# Altium schematic sheet Main.SchDoc: Knattebol Controller
size 431 x 279 mm; Date: 2021-10-17; ApprovedBy: Motonaut; CheckedBy: Motonaut; Author: Motonaut; CompanyName: Motonaut Inc.; DrawnBy: Motonau; Engineer: Motonaut; Organization: ETA; Address1: Rännvägen 4B; Address2: 412 96; Address3: Göteborg; Address4: Sweden; DocumentNumber: 3; Revision: REV C; SheetNumber: 1; SheetTotal: 2; Project: Knattebol; ENG_APP_DATE: --/--/--; DSN_APP_DATE: --/--/--; CHK_APP_DATE: --/--/--; Time: 14:33
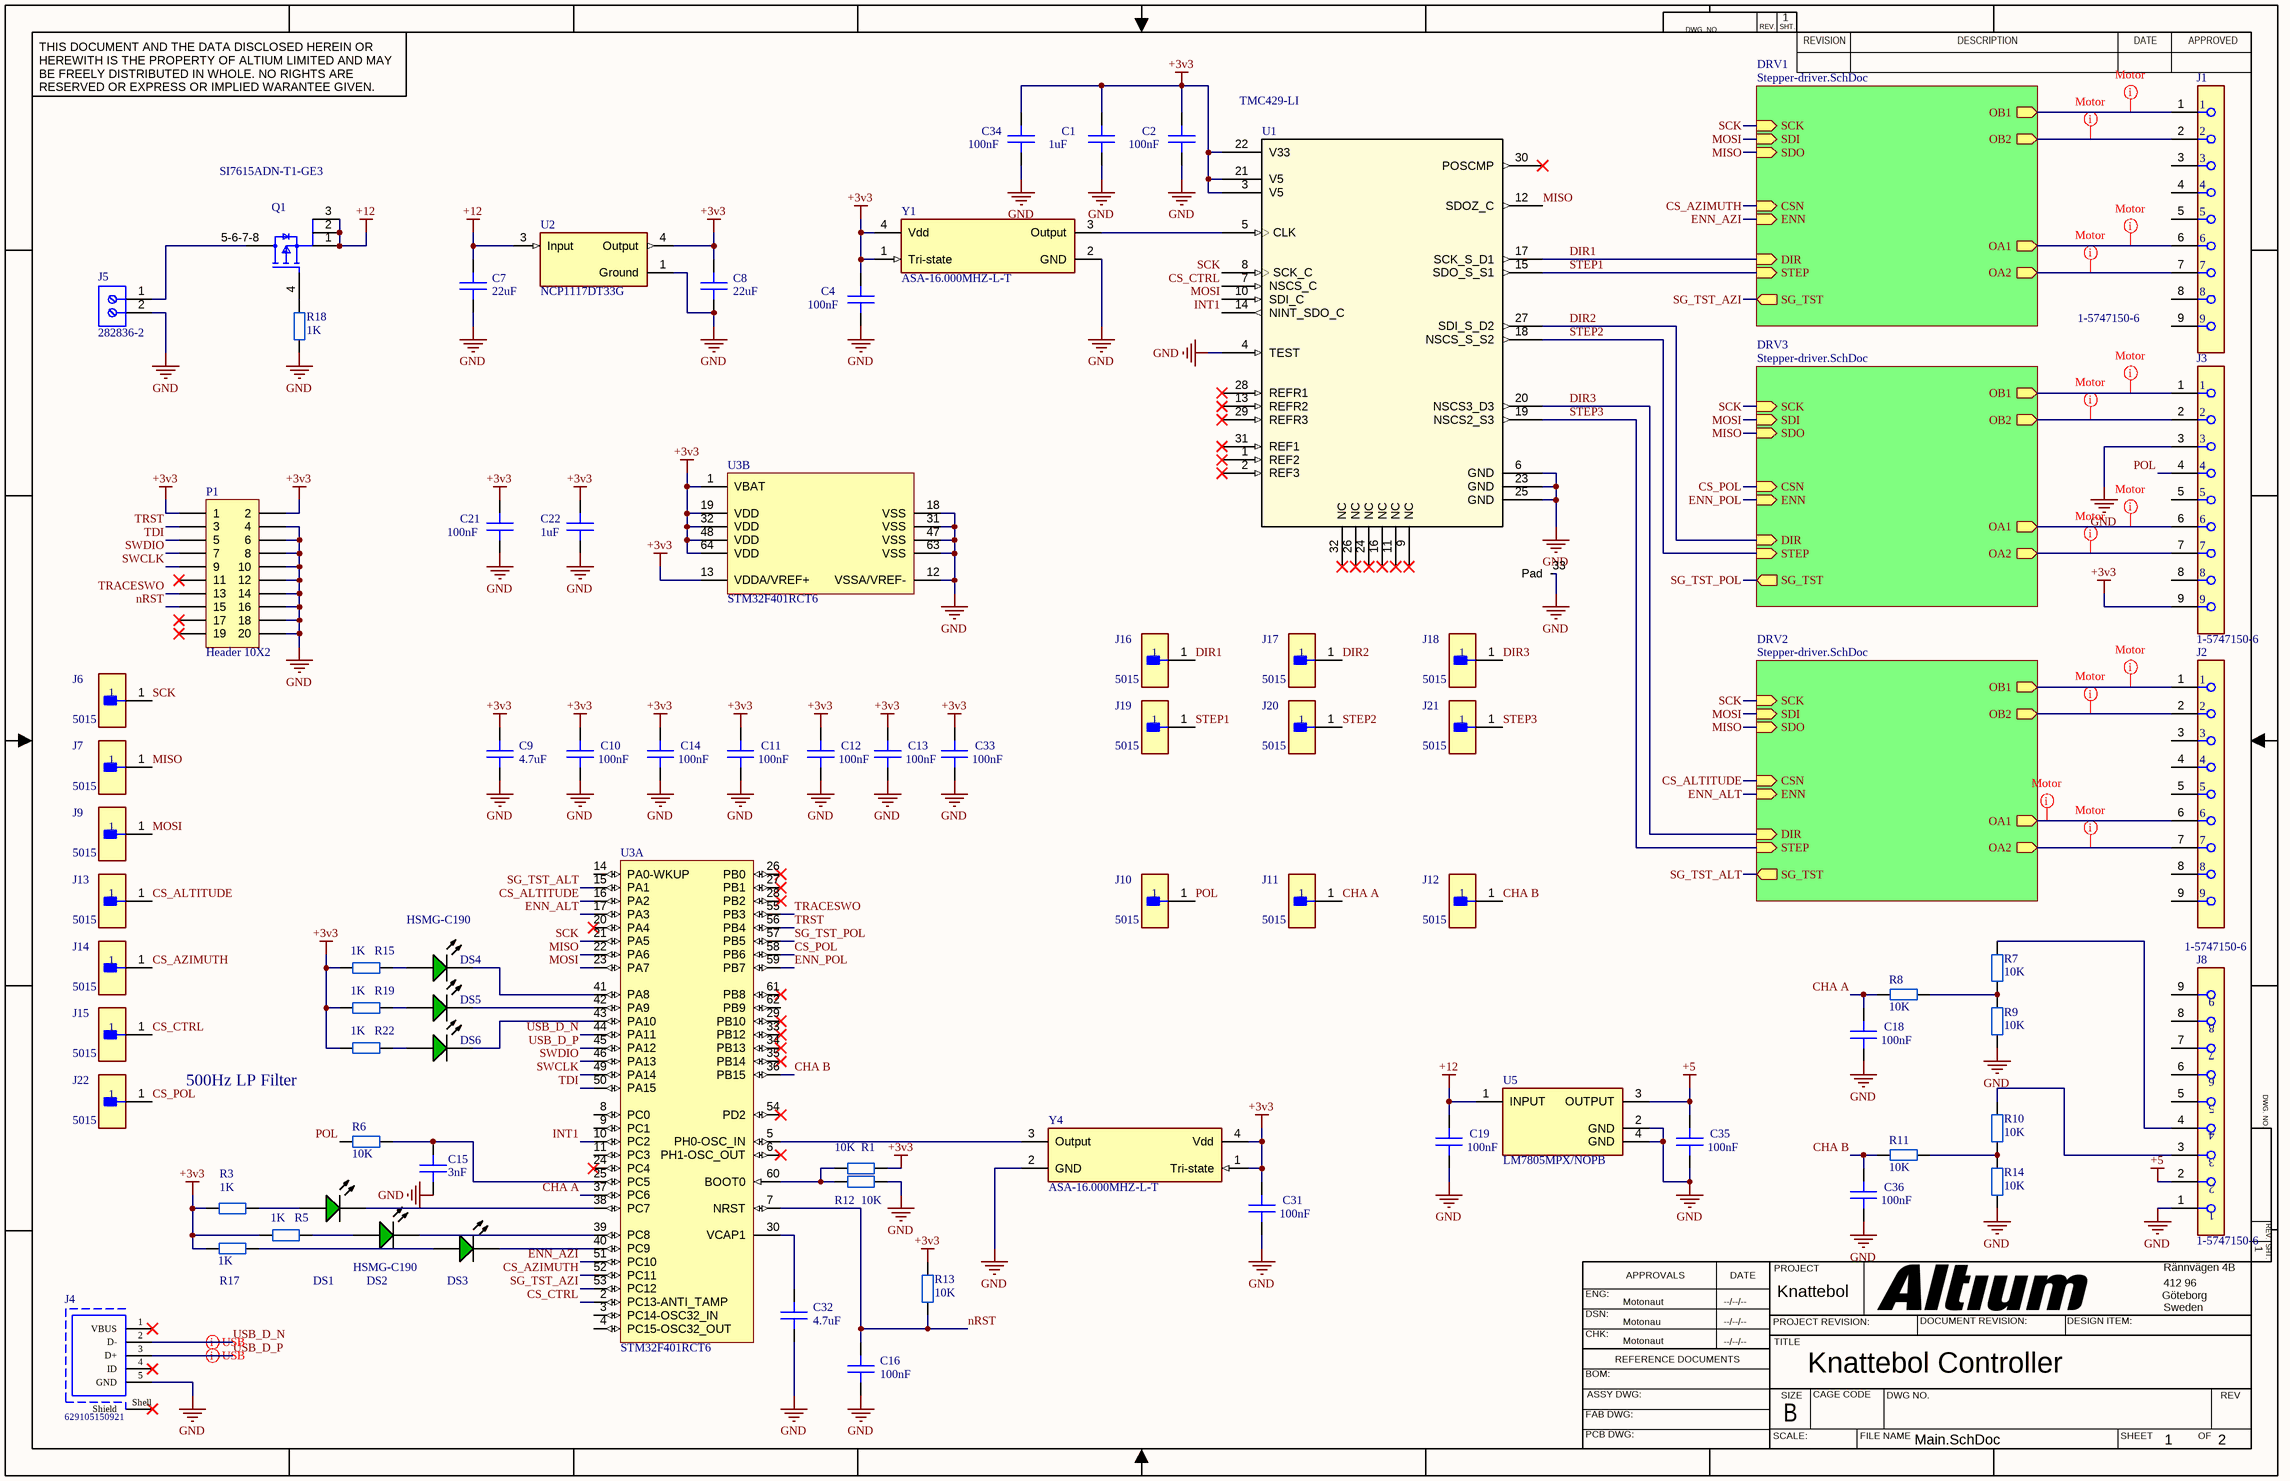
[diagram p0: Main.SchDoc]

## Parts
C1  value 1uF  [C0603 (1608)]  (hidden comment: Cap SMD)
C2  value 100nF  [C0603 (1608)]  (hidden comment: Cap SMD)
C4  value 100nF  [C0603 (1608)]  (hidden comment: Cap SMD)
C7  value 22uF  [C0603 (1608)]  (hidden comment: Cap SMD)
C8  value 22uF  [C0603 (1608)]  (hidden comment: Cap SMD)
C9  value 4.7uF  [C0603 (1608)]  (hidden comment: Cap SMD)
C10  value 100nF  [C0603 (1608)]  (hidden comment: Cap SMD)
C11  value 100nF  [C0603 (1608)]  (hidden comment: Cap SMD)
C12  value 100nF  [C0603 (1608)]  (hidden comment: Cap SMD)
C13  value 100nF  [C0603 (1608)]  (hidden comment: Cap SMD)
C14  value 100nF  [C0603 (1608)]  (hidden comment: Cap SMD)
C15  value 3nF  [C0603 (1608)]  (hidden comment: Cap SMD)
C16  value 100nF  [C0603 (1608)]  (hidden comment: Cap SMD)
C18  value 100nF  [C0603 (1608)]  (hidden comment: Cap SMD)
C19  value 100nF  [C0603 (1608)]  (hidden comment: Cap SMD)
C21  value 100nF  [C0603 (1608)]  (hidden comment: Cap SMD)
C22  value 1uF  [C0603 (1608)]  (hidden comment: Cap SMD)
C31  value 100nF  [C0603 (1608)]  (hidden comment: Cap SMD)
C32  value 4.7uF  [C0603 (1608)]  (hidden comment: Cap SMD)
C33  value 100nF  [C0603 (1608)]  (hidden comment: Cap SMD)
C34  value 100nF  [C0603 (1608)]  (hidden comment: Cap SMD)
C35  value 100nF  [C0603 (1608)]  (hidden comment: Cap SMD)
C36  value 100nF  [C0603 (1608)]  (hidden comment: Cap SMD)
DS1  HSMG-C190  [AVAG-HSMX-C190_V]  (value not drawn)
DS2  HSMG-C190  [AVAG-HSMX-C190_V]  (value not drawn)
DS3  HSMG-C190  [AVAG-HSMX-C190_V]
DS4  HSMG-C190  [AVAG-HSMX-C190_V]
DS5  HSMG-C190  [AVAG-HSMX-C190_V]  (value not drawn)
DS6  HSMG-C190  [AVAG-HSMX-C190_V]  (value not drawn)
J1  1-5747150-6  [FP-1-5747150-6-MFG]
J2  1-5747150-6  [FP-1-5747150-6-MFG]
J3  1-5747150-6  [FP-1-5747150-6-MFG]
J4  629105150921  [629105150921]
J5  282836-2  [TECO-282836-2_V]
J6  5015  [FP-5015-MFG]
J7  5015  [FP-5015-MFG]
J8  1-5747150-6  [FP-1-5747150-6-MFG]
J9  5015  [FP-5015-MFG]
J10  5015  [FP-5015-MFG]
J11  5015  [FP-5015-MFG]
J12  5015  [FP-5015-MFG]
J13  5015  [FP-5015-MFG]
J14  5015  [FP-5015-MFG]
J15  5015  [FP-5015-MFG]
J16  5015  [FP-5015-MFG]
J17  5015  [FP-5015-MFG]
J18  5015  [FP-5015-MFG]
J19  5015  [FP-5015-MFG]
J20  5015  [FP-5015-MFG]
J21  5015  [FP-5015-MFG]
J22  5015  [FP-5015-MFG]
P1  Header 10X2  [HDR2X10]
Q1  SI7615ADN-T1-GE3  [FP-S16-2667_SINGLE-MFG]
R1  10K  [R0603 (1608)]
R3  1K  [R0603 (1608)]
R5  1K  [R0603 (1608)]
R6  10K  [R0603 (1608)]
R7  10K  [R0603 (1608)]
R8  10K  [R0603 (1608)]
R9  10K  [R0603 (1608)]
R10  10K  [R0603 (1608)]
R11  10K  [R0603 (1608)]
R12  10K  [R0603 (1608)]
R13  10K  [R0603 (1608)]
R14  10K  [R0603 (1608)]
R15  1K  [R0603 (1608)]
R17  1K  [R0603 (1608)]
R18  1K  [R0603 (1608)]
R19  1K  [R0603 (1608)]
R22  1K  [R0603 (1608)]
U1  TMC429-LI  [QFN32_5X5_TRI-M]
U2  NCP1117DT33G  [FP-369C-MFG]
U3  STM32F401RCT6  [STM-LQFP64_M]  (parts A,B of 2)
U5  LM7805MPX/NOPB  [FP-LM7805MPX-NOPB-MFG]
Y1  ASA-16.000MHZ-L-T  [FP-ASA-MFG]
Y4  ASA-16.000MHZ-L-T  [FP-ASA-MFG]

## Sub-sheets
DRV1 = Stepper-driver.SchDoc: SCK (in), SDI (in), SDO (in), CSN (in), ENN (in), DIR (in), STEP (in), SG_TST (out), OB1 (out), OB2 (out), OA1 (out), OA2 (out)
DRV2 = Stepper-driver.SchDoc: SCK (in), SDI (in), SDO (in), CSN (in), ENN (in), DIR (in), STEP (in), SG_TST (out), OB1 (out), OB2 (out), OA1 (out), OA2 (out)
DRV3 = Stepper-driver.SchDoc: SCK (in), SDI (in), SDO (in), CSN (in), ENN (in), DIR (in), STEP (in), SG_TST (out), OA2 (out), OA1 (out), OB1 (out), OB2 (out)

## Nets
+3v3: C1.2 C2.2 C4.2 C8.2 C9.2 C10.2 C11.2 C12.2 C13.2 C14.2 C21.2 C22.2 C31.2 C33.2 C34.2 J3.9 P1.1 P1.2 R1.2 R3.1 R5.1 R13.2 R15.1 R17.1 R19.1 R22.1 U1.3(V5) U1.21(V5) U1.22(V33) U2.4(Output) U3.1(VBAT) U3.13(VDDA/VREF+) U3.19(VDD) U3.32(VDD) U3.48(VDD) U3.64(VDD) Y1.1(Tri-state) Y1.4(Vdd) Y4.1(Tri-state) Y4.4(Vdd)
+5: C35.2 J8.2 U5.3(OUTPUT)
+12: C7.2 C19.2 Q1.1(S) Q1.2(S) Q1.3(S) U2.3(Input) U5.1(INPUT)
GND: C1.1 C2.1 C4.1 C7.1 C8.1 C9.1 C10.1 C11.1 C12.1 C13.1 C14.1 C15.1 C16.1 C18.1 C19.1 C21.1 C22.1 C31.1 C32.1 C33.1 C34.1 C35.1 C36.1 J3.3 J4.5(GND) J5.2 J8.1 P1.4 P1.6 P1.8 P1.10 P1.12 P1.14 P1.16 P1.18 P1.20 R9.1 R12.2 R14.1 R18.1 U1.4(TEST) U1.6(GND) U1.23(GND) U1.25(GND) U1.33(Pad) U2.1(Ground) U3.12(VSSA/VREF-) U3.18(VSS) U3.31(VSS) U3.47(VSS) U3.63(VSS) U5.2(GND) U5.4(GND) Y1.2(GND) Y4.2(GND)
CHA A: C18.2 J11.1 R8.2 U3.37(PC6)
CHA B: C36.2 J12.1 R11.2 U3.36(PB15)
CS_ALTITUDE: J13.1 U3.16(PA2) ; sheet DRV2/CSN
CS_AZIMUTH: J14.1 U3.52(PC11) ; sheet DRV1/CSN
CS_CTRL: J15.1 U1.7(NSCS_C) U3.2(PC13-ANTI_TAMP)
CS_POL: J22.1 U3.58(PB6) ; sheet DRV3/CSN
DIR1: J16.1 U1.17(SCK_S_D1) ; sheet DRV1/DIR
DIR2: J17.1 U1.27(SDI_S_D2) ; sheet DRV3/DIR
DIR3: J18.1 U1.20(NSCS3_D3) ; sheet DRV2/DIR
ENN_ALT: U3.17(PA3) ; sheet DRV2/ENN
ENN_AZI: U3.51(PC10) ; sheet DRV1/ENN
ENN_POL: U3.59(PB7) ; sheet DRV3/ENN
INT1: U1.14(NINT_SDO_C) U3.10(PC2)
MISO: J7.1 U1.12(SDOZ_C) U3.22(PA6) ; sheet DRV2/SDO, sheet DRV3/SDO, sheet DRV1/SDO
MOSI: J9.1 U1.10(SDI_C) U3.23(PA7) ; sheet DRV2/SDI, sheet DRV3/SDI, sheet DRV1/SDI
nRST: C16.2 P1.15 R13.1 U3.7(NRST)
POL: J3.4 J10.1 R6.1
SCK: J6.1 U1.8(SCK_C) U3.21(PA5) ; sheet DRV2/SCK, sheet DRV3/SCK, sheet DRV1/SCK
SG_TST_ALT: U3.15(PA1) ; sheet DRV2/SG_TST
SG_TST_AZI: U3.53(PC12) ; sheet DRV1/SG_TST
SG_TST_POL: U3.57(PB5) ; sheet DRV3/SG_TST
STEP1: J19.1 U1.15(SDO_S_S1) ; sheet DRV1/STEP
STEP2: J20.1 U1.18(NSCS_S_S2) ; sheet DRV3/STEP
STEP3: J21.1 U1.19(NSCS2_S3) ; sheet DRV2/STEP
SWCLK: P1.9 U3.49(PA14)
SWDIO: P1.7 U3.46(PA13)
TDI: P1.5 U3.50(PA15)
TRACESWO: P1.13 U3.55(PB3)
TRST: P1.3 U3.56(PB4)
USB_D_N: J4.2(D-) U3.44(PA11)
USB_D_P: J4.3(D+) U3.45(PA12)
NetC15_2: C15.2 R6.2 U3.25(PC5)
NetC32_2: C32.2 U3.30(VCAP1)
NetDS1_1: DS1.1(A) R3.2
NetDS1_2: DS1.2(K) U3.38(PC7)
NetDS2_1: DS2.1(A) R5.2
NetDS2_2: DS2.2(K) U3.39(PC8)
NetDS3_1: DS3.1(A) R17.2
NetDS3_2: DS3.2(K) U3.40(PC9)
NetDS4_1: DS4.1(A) R15.2
NetDS4_2: DS4.2(K) U3.41(PA8)
NetDS5_1: DS5.1(A) R19.2
NetDS5_2: DS5.2(K) U3.42(PA9)
NetDS6_1: DS6.1(A) R22.2
NetDS6_2: DS6.2(K) U3.43(PA10)
NetJ1_1: J1.1 ; sheet DRV1/OB1
NetJ1_2: J1.2 ; sheet DRV1/OB2
NetJ1_6: J1.6 ; sheet DRV1/OA1
NetJ1_7: J1.7 ; sheet DRV1/OA2
NetJ2_1: J2.1 ; sheet DRV2/OB1
NetJ2_2: J2.2 ; sheet DRV2/OB2
NetJ2_6: J2.6 ; sheet DRV2/OA1
NetJ2_7: J2.7 ; sheet DRV2/OA2
NetJ3_1: J3.1 ; sheet DRV3/OB1
NetJ3_2: J3.2 ; sheet DRV3/OB2
NetJ3_6: J3.6 ; sheet DRV3/OA1
NetJ3_7: J3.7 ; sheet DRV3/OA2
NetJ5_1: J5.1 Q1.5-6-7-8(D)
NetJ8_3: J8.3 R10.2
NetJ8_4: J8.4 R7.2
NetQ1_4: Q1.4(G) R18.2
NetR1_1: R1.1 R12.1 U3.60(BOOT0)
NetR7_1: R7.1 R8.1 R9.2
NetR10_1: R10.1 R11.1 R14.2
NetU1_5: U1.5(CLK) Y1.3(Output)
NetU3_5: U3.5(PH0-OSC_IN) Y4.3(Output)

Not connected (* = marked no-connect by the designer): J1 3 4 5 8 9; J2 3 4 5 8 9; J3 5 8; J4 1(VBUS)* 4(ID)* Shell(Shield)*; J8 5 6 7 8 9; P1 11* 17* 19*; U1 1(REF2)* 2(REF3)* 9(NC)* 11(NC)* 13(REFR2)* 16(NC)* 24(NC)* 26(NC)* 28(REFR1)* 29(REFR3)* 30(POSCMP)* 31(REF1)* 32(NC)*; U3 3(PC14-OSC32_IN) 4(PC15-OSC32_OUT) 6(PH1-OSC_OUT)* 8(PC0) 9(PC1) 11(PC3) 14(PA0-WKUP) 20(PA4)* 24(PC4)* 26(PB0)* 27(PB1)* 28(PB2)* 29(PB10)* 33(PB12)* 34(PB13)* 35(PB14)* 54(PD2)* 61(PB8)* 62(PB9)

## Layout directives
net class Motor: NetJ1_2, NetJ1_6, NetJ1_7, NetJ2_1, NetJ2_2, NetJ2_6, NetJ2_7, NetJ3_1, NetJ3_2, NetJ3_6, NetJ3_7
net class Power; net class Motor: NetJ1_1
differential pair; differential pair class USB; net class USB: USB_D_N
differential pair; differential pair class USB; Differential Pairs Routing: Pref Gap = 10mil; Differential Pairs Routing 2: Min Gap = 10mil; net class USB: USB_D_P

## Notes on the sheet
- 500Hz LP Filter
- DWG. NO.
- REV.
- SHT.
- THIS DOCUMENT AND THE DATA DISCLOSED HEREIN OR HEREWITH IS THE PROPERTY OF ALTIUM LIMITED AND MAY BE FREELY DISTRIBUTED IN WHOLE. NO RIGHTS ARE RESERVED OR EXPRESS OR IMPLIED WARANTEE GIVEN.
- REVISION
- DESCRIPTION
- DATE
- APPROVED
- ENG:
- APPROVALS
- PROJECT
- DSN:
- CHK:
- REFERENCE DOCUMENTS
- PROJECT REVISION:
- TITLE
- DOCUMENT REVISION:
- DESIGN ITEM:
- BOM:
- FAB DWG:
- PCB DWG:
- ASSY DWG:
- SCALE:
- SIZE
- B
- CAGE CODE
- FILE NAME
- DWG NO.
- SHEET
- OF
- REV

## Library data of the parts
DS1-DS6 = CMP-1744-00002-1: Chip LED, Green, 2.2 V, -40 to 85 degC, 2-Pin SMD, RoHS, Tape and Reel; Frequency: 400 KHz; Max Supply Voltage: 5.5 V; Access Time: 3500 ns; Clock Frequency: 100 KHz; Case\Package: SOIC; Density: 32 kb; Nominal Supply Current: 2 mA; Interface: Serial; Min Supply Voltage: 1.7 V; Packaging: Tape and Reel; PackageReference: HSMX-C190; ComponentLink2URL: http://docs.avagotech.com/docs/AV02-0551EN; RoHSCompliant: true; Pins: 8; REACH SVHC: No SVHC; Max Operating Temperature: 85 degC; Width: 4 mm; Radiation Hardening: No; Package Quantity: 3000; ComponentLink3Description: Package Specification; ComponentLink1Description: Manufacturer URL; Min Operating Temperature: -40 degC; PackageDescription: 2-Pin Surface Mount Device, Body 1.6 x 0.8 mm, Height 0.9 mm; Max Clock Frequency: 100 KHz; Height: 1.5 mm; ComponentLink1URL: http://www.avagotech.com/; DatasheetVersion: Mar-12; ComponentLink2Description: Datasheet; Mount: Surface Mount; Length: 5 mm; ComponentLink3URL: http://www.fairchildsemi.com/dwg/MA/MA03D.pdf
J1-J3 J8 = CMP-03367-000009-1: CONN D-SUB RCPT 9POS VERT SOLDER; Manufacturer: TE Connectivity; Is Female: yes; Current Rating: 6A; Conn Orientation: Vertical; Conn Gender: Female; Shielding: false; Number Of Contacts: 9; Pitch: 2.74mm; ComponentLink2URL: https://www.te.com/usa-en/product-1-5747150-6.html?te_bu=Cor&te_type=other&te_campaign=oct_glo_cor-oct-global-oth-prtnr-fy19-oct-octo-buy-bom_sma-298_2&elqCampaignId=35216; Manufacturer Part Number: 1-5747150-6; Temperature: -55°C to +105°C; Mouser Description: D-Sub Standard Connectors RECP FRNT MTL SHL 9P female screwlocks; Octopart: https://octopart.com/1-5747150-6-te+connectivity-39500344; Category: Conn; Automotive: No; Package: 1-5747150-6; Device Class L3: unset; Contact Material: Gold,Nickel; Lead Free: Yes; Height: 12.54mm; RoHS: TRUE; ComponentLink2Description: Datasheet; Device Class L2: D-Sub Connectors; Device Class L1: Connectors; Digikey Description: CONN D-SUB RCPT 9POS VERT SOLDER; Temperature Range High: +105°C; Temperature Range Low: -55°C
J4 = CMP-1502-03249-1: Micro USB 2.0 Type AB Receptacle WR-COM, Horizontal, SMT; Manufacturer: Wurth Elektronik; Rated Current: 1.8A; Contact Resistance: 30mOhm; Working Voltage: 30VAC; Publisher: WurthElektronik; Part Number: 629105150921; Operating Temperature: -40to85degC; Gender: Receptacle; Packaging: TapeandReel; Connector Type: MicroUSB2.0TypeAB; Datasheet URL: https://katalog.we-online.de/em/datasheet/629105150921.pdf; Mounting Technology: SMT; Orientation: Horizontal; Package Reference: 629105150921; Manufacturer URL: http://www.we-online.de
J5 = CMP-1684-00017-1: Female Header, Pitch 5 mm, 1 x 2 Position, Height 10 mm, Tail Length 3.5 mm, Rohs, Bulk; Manufacturer: TE Connectivity; Wire Gauge: 16-30AWG; Product Training Modules: Wire-to-BoardEurostyleTerminalBlocks; Clamp Material - Plating: Brass-NickelPlated; Voltage: 300V; Mating Orientation: HorizontalwithBoard; Current: 13.5A; Pitch: 0.197"(5.00mm); Screw Thread: M3; 3D Model: 282836-2.pdf; Other Names: 5ULV-02B / A98076; Dynamic Catalog: BuchananSeries; Number of Levels: 1; Torque - Screw: 0.68Nm(6Lb-In); Featured Product: EurostyleTerminalBlockConnectors; Positions Per Level: 2; Wire Termination: Screw-RisingCageClamp; Datasheet URL: http://www.te.com.cn/commerce/DocumentDelivery/DDEController?Action=showdoc&DocId=Catalog+Section%7F1308389_EUROSTYLE_TERMINAL_BLOCKS%7F0607%7Fpdf%7FEnglish%7FENG_CS_1308389_EUROSTYLE_TERMINAL_BLOCKS_0607.pdf%7F282836-2; Color: Green; Family: TerminalBlocks-WiretoBoard; RoHS Information: 282836-2StatementofCompliance; Standard Package: 300; Contact Material - Plating: Brass-TinPlated; Manufacturer URL: http://www.te.com; Housing Material: Polyamide(PA66),Nylon6/6; Features: Interlocking(Side); Package Description: Female Header, Pitch 5 mm, 1 x 2 Position, Height 10 mm, Tail Length 3.5 mm; Mounting Type: ThroughHole; Package Reference: THD; Packaging: Bulk; Series: Buchanan; Category: Connectors,Interconnects; Screw Material - Plating: Brass-NickelPlated
J6 J7 J9-J22 = CMP-2000-05183-2: PC TEST POINT MINIATURE; Manufacturer: keystone; Number Of Contacts: 1; Conn Orientation: Straight; Category: Conn; Manufacturer Part Number: 5015; Digikey Description: PC TEST POINT MINIATURE; Automotive: No; Lead Free: Yes; Octopart: https://octopart.com/5015-keystone-3822; ComponentLink2URL: http://www.keyelco.com/product-pdf.cfm?p=1353; Package: 5015; RoHS: TRUE; Device Class L3: unset; Device Class L2: unset; Contact Material: Silver; Device Class L1: Connectors; Height: 1.65mm; ComponentLink2Description: Datasheet
P1 = Header 10X2: Header, 10-Pin, Dual row; LatestRevisionDate: 17-Jul-2002; LatestRevisionNote: Re-released for DXP Platform.; Publisher: Altium Limited
Q1 = CMP-02550-000167-1: MOSFET P-CH 20V 35A 1212-8S; Manufacturer: Vishay; Gate Charge At Vgs: 122nC @ -10V; Max Forward Diode Voltage: -1.1V; Continuous Drain Current: -22.1A; Gate To Source Voltage: 12V; Number Of P Channels: 1; Pulse Drain Current: -80A; Threshold Vgs Max: -1.5V; Drain To Source Voltage: -20V; Reverse Recovery Time: 27ns; Depletion Mode: False; Reverse Recovery Charge: 11nC; Power Dissipation: 3.7W; Rthja Max: 33°C/W; Typ Forward Diode Voltage: -0.72V; Standoff Height: 0mm; Input Capacitace At Vds: 5590pF @ -10V; Turn On Delay Time: 13ns; Turn Off Delay Time: 85ns; Max Junction Temp: +150°C; Transconductance: 82S; Threshold Vgs Min: -0.4V; Drain To Source Resistance: 0.0035Ω; Manufacturer Part Number: SI7615ADN-T1-GE3; Package: S16-2667_SINGLE; Height: 1.12mm; Automotive: No; Device Class L3: MOSFETs; Device Class L1: Discrete Semiconductors; Digikey Description: MOSFET P-CH 20V 35A 1212-8S; Category: Trans; Device Class L2: Transistors; Drain To Source Breakdown Voltage: -20V; Temperature Range High: +150°C; Octopart: https://octopart.com/si7615adn-t1-ge3-vishay-45331111; Number Of Channels: 1; RoHS: TRUE; Temperature: -55°C to +150°C; ComponentLink2URL: http://www.vishay.com/docs/62667/si7615adn.pdf; Temperature Range Low: -55°C; Lead Free: Yes; ComponentLink2Description: Datasheet; Mouser Description: MOSFET -20V 4.4mOhm@10V 35A P-Ch G-III
R1 R3 R5-R15 R17-R19 R22 = Resistor EU
U1 = TMC429-LI: No Description Available; Built_By: EMA_Jessica; Vendor: TRINAMIC; SourceLibrary: Trinamic_2018-10-17; Copyright: Copyright (C) 2016 Accelerated Designs. All rights reserved; Manufacturer_Part_Number: TMC429-LI; RefDes: RefDes; Type: DEV
U2 = CMP-07128-000008-1: IC REG LINEAR 3.3V 1A DPAK; Manufacturer: ON Semiconductor; Dropout Voltage: 1.2V; Nominal Supply Current: 6mA; Number Of Outputs: 1; Max Supply Voltage: 20V; Max Junction Temp: +150°C; Min Supply Voltage: 2.4V; Accuracy Percentage: 1%; Output Type: Fixed; Standoff Height: 0mm; Package: 369C; Lead Free: Yes; Temperature Range Low: -55°C; Automotive: No; Digikey Description: IC REG LINEAR 3.3V 1A DPAK; ComponentLink2Description: Datasheet; Footprint Url: https://www.onsemi.com/pub/Collateral/369C.PDF; Output Voltage: 3.3V; Manufacturer Part Number: NCP1117DT33G; Device Class L2: Power Management ICs; RoHS: TRUE; Device Class L3: Voltage Regulators - Linear; Mouser Description: LDO Voltage Regulators 3.3V 1A Positive; Output Current: 1A; Ambient Temperature Range Low: 0°C; Height: 2.51mm; Octopart: https://octopart.com/ncp1117dt33g-on+semiconductor-1381653; Temperature Range High: +150°C; Temperature: -55°C to +150°C; Device Class L1: Integrated Circuits (ICs); ComponentLink2URL: https://www.onsemi.jp/PowerSolutions/document/NCP1117-D.PDF; Ambient Temperature Range High: +125°C; Category: IC
U3 = CMP-0243-00091-2: ARM Cortex-M4 32-bit MCU+FPU, 105 DMIPS, 256 kB Flash, 64 kB Internal RAM, 48 I/Os, 64-pin LQFP, -40 to 85 degC, Tray; Manufacturer: STMicroelectronics; Internal RAM Size (kB): 64; Supply Voltage(Vcc) max (V): 3.6; FLASH Size (Prog) (kB): 256; I/Os (High Current): 48; Operating Frequency(F) (Processor speed) (MHz): 84; Supply Voltage(Vcc) min (V): 1.8; DatasheetVersion: Rev. 1; ComponentLink1URL: http://www.st.com/web/en/home.html; ComponentLink1Description: Manufacturer URL; PackageDescription: 64-Pin Low Profile Quad Flat Package, 10 x 10 mm Body, 0.5 mm Pitch; Packing: Tray; ComponentLink3URL: http://www.st.com/st-web-ui/static/active/en/resource/technical/document/datasheet/DM00037051.pdf; PackageVersion: Rev. 4, 06/2013; ComponentLink2URL: http://www.st.com/st-web-ui/static/active/en/resource/technical/document/data_brief/DM00071938.pdf; PartNumber: STM32F401RCT6; PackageReference: LQFP64; Mounting Technology: Surface Mount; ComponentLink2Description: Datasheet; ComponentLink3Description: Package Specification; Core: ARM Cortex-M4
U5 = CMP-04917-000022-1: IC REG LINEAR 5V 1.5A SOT223-4; Manufacturer: Texas Instruments; Dropout Voltage: 2V; Output Type: Fixed; Accuracy Percentage: 3%; Nominal Supply Current: 8mA; Standoff Height: 0.02mm; Min Supply Voltage: 7.5V; Number Of Outputs: 1; Max Junction Temp: +150°C; Max Supply Voltage: 30V; Height: 1.8mm; Temperature Range High: +125°C; Device Class L3: Voltage Regulators - Linear; Lead Free: Yes; Digikey Description: IC REG LINEAR 5V 1.5A SOT223-4; Output Current: 1.5A; Manufacturer Part Number: LM7805MPX/NOPB; Automotive: No; Device Class L1: Integrated Circuits (ICs); ComponentLink2Description: Datasheet; Device Class L2: Power Management ICs; Category: IC; Octopart: https://octopart.com/lm7805mpx%2Fnopb-texas+instruments-74629992; Package: SOT223-4; RoHS: TRUE; Output Voltage: 5V; Temperature Range Low: 0°C; Temperature: 0°C to +125°C; ComponentLink2URL: http://www.ti.com/lit/ds/symlink/lm7800.pdf
Y1 Y4 = CMP-27762-000001-1: XTAL OSC XO 16.0000MHZ HCMOS SMD; Manufacturer: Abracon; Max Supply Current: 5mA; Max Supply Voltage: 3.66V; Load Capacitance: 15pF; Stability: 50ppm; Frequency: 16MHz; Min Supply Voltage: 2.97V; Category: Crys; Package: ASA; Temperature Range High: +85°C; Device Class L1: Passive Components; Octopart: https://octopart.com/asa-16.000mhz-l-t-abracon-21707822; Device Class L3: Oscillators; Temperature Range Low: -40°C; ComponentLink2Description: Datasheet; Mouser Description: Standard Clock Oscillators 16.000MHz 3.3V -40C +85C; Height: 0.8mm; Series: ASA; Automotive: No; Device Class L2: Crystals / Oscillators; Manufacturer Part Number: ASA-16.000MHZ-L-T; ComponentLink2URL: https://abracon.com/Oscillators/ASA.pdf; Digikey Description: XTAL OSC XO 16.0000MHZ HCMOS SMD; Footprint Url: https://abracon.com/Support/PackageDrawing/Oscillators/ASA.PDF; Temperature: -40°C to +85°C; RoHS: TRUE; Lead Free: Yes